# Altium project PCB_Project.PrjPcb
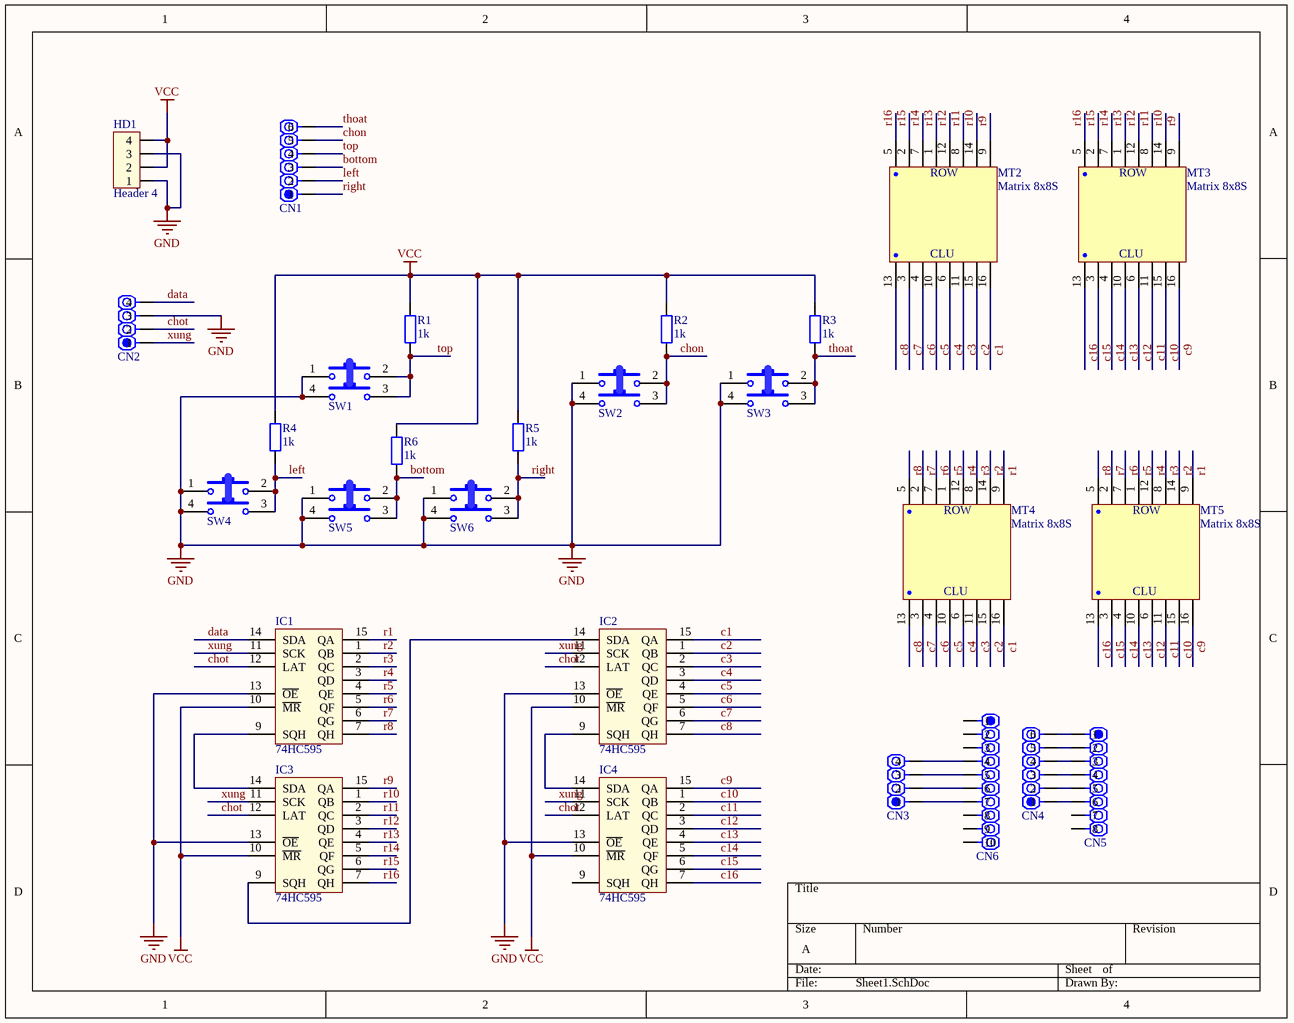
[diagram p0: Sheet1.SchDoc]
1 sheet, 27 parts. Net scope: global (net labels, ports and power ports of the same name join across sheets).
Board file: PCB1.PcbDoc

## Sheet Sheet1.SchDoc
size A

### Parts
CN1  IO  [CON.HDR1X6]  (value not drawn)
CN2  IO  [CON.HDR1X4]  (value not drawn)
CN3  IO  [CON.HDR1X4]  (value not drawn)
CN4  IO  [CON.HDR1X6]  (value not drawn)
CN5  CON.HDR1x8  [HDR1X8]  (value not drawn)
CN6  CON.HDR1x10  [HDR1X10]  (value not drawn)
HD1  Header 4  [HED4]
IC1  74HC595  [DIP16]
IC2  74HC595  [DIP16]
IC3  74HC595  [DIP16]
IC4  74HC595  [DIP16]
MT2  Matrix 8x8S  [matrix]
MT3  Matrix 8x8S  [matrix]
MT4  Matrix 8x8S  [matrix]
MT5  Matrix 8x8S  [matrix]
R1  1k  [R1/4W]
R2  1k  [R1/4W]
R3  1k  [R1/4W]
R4  1k  [R1/4W]
R5  1k  [R1/4W]
R6  1k  [R1/4W]
SW1  SW-4P-B  [SW-4P-B]  (value not drawn)
SW2  SW-4P-B  [SW-4P-B]  (value not drawn)
SW3  SW-4P-B  [SW-4P-B]  (value not drawn)
SW4  SW-4P-B  [SW-4P-B]  (value not drawn)
SW5  SW-4P-B  [SW-4P-B]  (value not drawn)
SW6  SW-4P-B  [SW-4P-B]  (value not drawn)

### Nets
GND: CN2.3 HD1.1 HD1.3 IC1.8(GND) IC1.13(~{OE}) IC2.8(GND) IC2.13(~{OE}) IC3.8(GND) IC3.13(~{OE}) IC4.8(GND) IC4.13(~{OE}) SW1.1 SW1.4 SW2.1 SW2.4 SW3.1 SW3.4 SW4.1 SW4.4 SW5.1 SW5.4 SW6.1 SW6.4
VCC: HD1.2 HD1.4 IC1.10(~{MR}) IC1.16(VCC) IC2.10(~{MR}) IC2.16(VCC) IC3.10(~{MR}) IC3.16(VCC) IC4.10(~{MR}) IC4.16(VCC) R1.2 R2.2 R3.2 R4.2 R5.2 R6.2
bottom: CN1.3 R6.1 SW5.2 SW5.3
c1: IC2.15(QA) MT2.16(C8) MT4.16(C8)
c2: IC2.1(QB) MT2.15(C7) MT4.15(C7)
c3: IC2.2(QC) MT2.11(C6) MT4.11(C6)
c4: IC2.3(QD) MT2.6(C5) MT4.6(C5)
c5: IC2.4(QE) MT2.10(C4) MT4.10(C4)
c6: IC2.5(QF) MT2.4(C3) MT4.4(C3)
c7: IC2.6(QG) MT2.3(C2) MT4.3(C2)
c8: IC2.7(QH) MT2.13(C1) MT4.13(C1)
c9: IC4.15(QA) MT3.16(C8) MT5.16(C8)
c10: IC4.1(QB) MT3.15(C7) MT5.15(C7)
c11: IC4.2(QC) MT3.11(C6) MT5.11(C6)
c12: IC4.3(QD) MT3.6(C5) MT5.6(C5)
c13: IC4.4(QE) MT3.10(C4) MT5.10(C4)
c14: IC4.5(QF) MT3.4(C3) MT5.4(C3)
c15: IC4.6(QG) MT3.3(C2) MT5.3(C2)
c16: IC4.7(QH) MT3.13(C1) MT5.13(C1)
chon: CN1.5 R2.1 SW2.2 SW2.3
chot: CN2.2 IC1.12(LAT) IC2.12(LAT) IC3.12(LAT) IC4.12(LAT)
data: CN2.4 IC1.14(SDA)
left: CN1.2 R4.1 SW4.2 SW4.3
r1: IC1.15(QA) MT4.9(H8) MT5.9(H8)
r2: IC1.1(QB) MT4.14(H7) MT5.14(H7)
r3: IC1.2(QC) MT4.8(H6) MT5.8(H6)
r4: IC1.3(QD) MT4.12(H5) MT5.12(H5)
r5: IC1.4(QE) MT4.1(H4) MT5.1(H4)
r6: IC1.5(QF) MT4.7(H3) MT5.7(H3)
r7: IC1.6(QG) MT4.2(H2) MT5.2(H2)
r8: IC1.7(QH) MT4.5(H1) MT5.5(H1)
r9: IC3.15(QA) MT2.9(H8) MT3.9(H8)
r10: IC3.1(QB) MT2.14(H7) MT3.14(H7)
r11: IC3.2(QC) MT2.8(H6) MT3.8(H6)
r12: IC3.3(QD) MT2.12(H5) MT3.12(H5)
r13: IC3.4(QE) MT2.1(H4) MT3.1(H4)
r14: IC3.5(QF) MT2.7(H3) MT3.7(H3)
r15: IC3.6(QG) MT2.2(H2) MT3.2(H2)
r16: IC3.7(QH) MT2.5(H1) MT3.5(H1)
right: CN1.1 R5.1 SW6.2 SW6.3
thoat: CN1.6 R3.1 SW3.2 SW3.3
top: CN1.4 R1.1 SW1.2 SW1.3
xung: CN2.1 IC1.11(SCK) IC2.11(SCK) IC3.11(SCK) IC4.11(SCK)
NetCN3_1: CN3.1 CN6.7
NetCN3_2: CN3.2 CN6.6
NetCN3_3: CN3.3 CN6.5
NetCN3_4: CN3.4 CN6.4
NetCN4_1: CN4.1 CN5.6
NetCN4_2: CN4.2 CN5.5
NetCN4_3: CN4.3 CN5.4
NetCN4_4: CN4.4 CN5.3
NetCN4_5: CN4.5 CN5.2
NetCN4_6: CN4.6 CN5.1
NetIC1_9: IC1.9(SQH) IC3.14(SDA)
NetIC2_9: IC2.9(SQH) IC4.14(SDA)
NetIC2_14: IC2.14(SDA) IC3.9(SQH)

Not connected (* = marked no-connect by the designer): CN5 7 8; CN6 1 2 3 8 9 10; IC4 9(SQH)

### Notes on the sheet
- (in symbol LED 8x8S) ROW; CLU

### Library data of the parts
CN1 CN4 = CON.HDR1x6: Header 1x6; Publisher: Hoang Nguyen; ComponentLink1Description: Digikey Part link; ComponentLink2Description: Open DataSheet; ComponentLink2URL: H:\LIBRARY\LIBRARY.Datasheet\
CN2 CN3 = CON.HDR1x4: Header 1x4; Publisher: Hoang Nguyen; ComponentLink1Description: Digikey Part link; ComponentLink2Description: Open DataSheet; ComponentLink2URL: H:\LIBRARY\LIBRARY.Datasheet\
CN5 = CON.HDR1x8: Header 1x8; Publisher: Hoang Nguyen; ComponentLink1Description: Digikey Part link; ComponentLink2Description: Open DataSheet; ComponentLink2URL: H:\LIBRARY\LIBRARY.Datasheet\
CN6 = CON.HDR1x10: Header 1x10; Publisher: Hoang Nguyen; ComponentLink1Description: Digikey Part link; ComponentLink2Description: Open DataSheet; ComponentLink2URL: H:\LIBRARY\LIBRARY.Datasheet\
HD1 = Header 4: Header 4 (Green); Value: Header 4
IC1-IC4 = 74595: 8 Bit Serial input - Parallel Output; Value: 74HC595
MT2-MT5 = LED 8x8S: Matrix 8x8,  Single colour; Value: Matrix 8x8S
R1-R6 = R1/4W: Resistor 1/4W; Value: R1/4W - 1K
SW1-SW6 = SW-4PIN-BIG: Switch Big 4 Pin